# Altium schematic sheet karmanDB_accel.SchDoc
size A
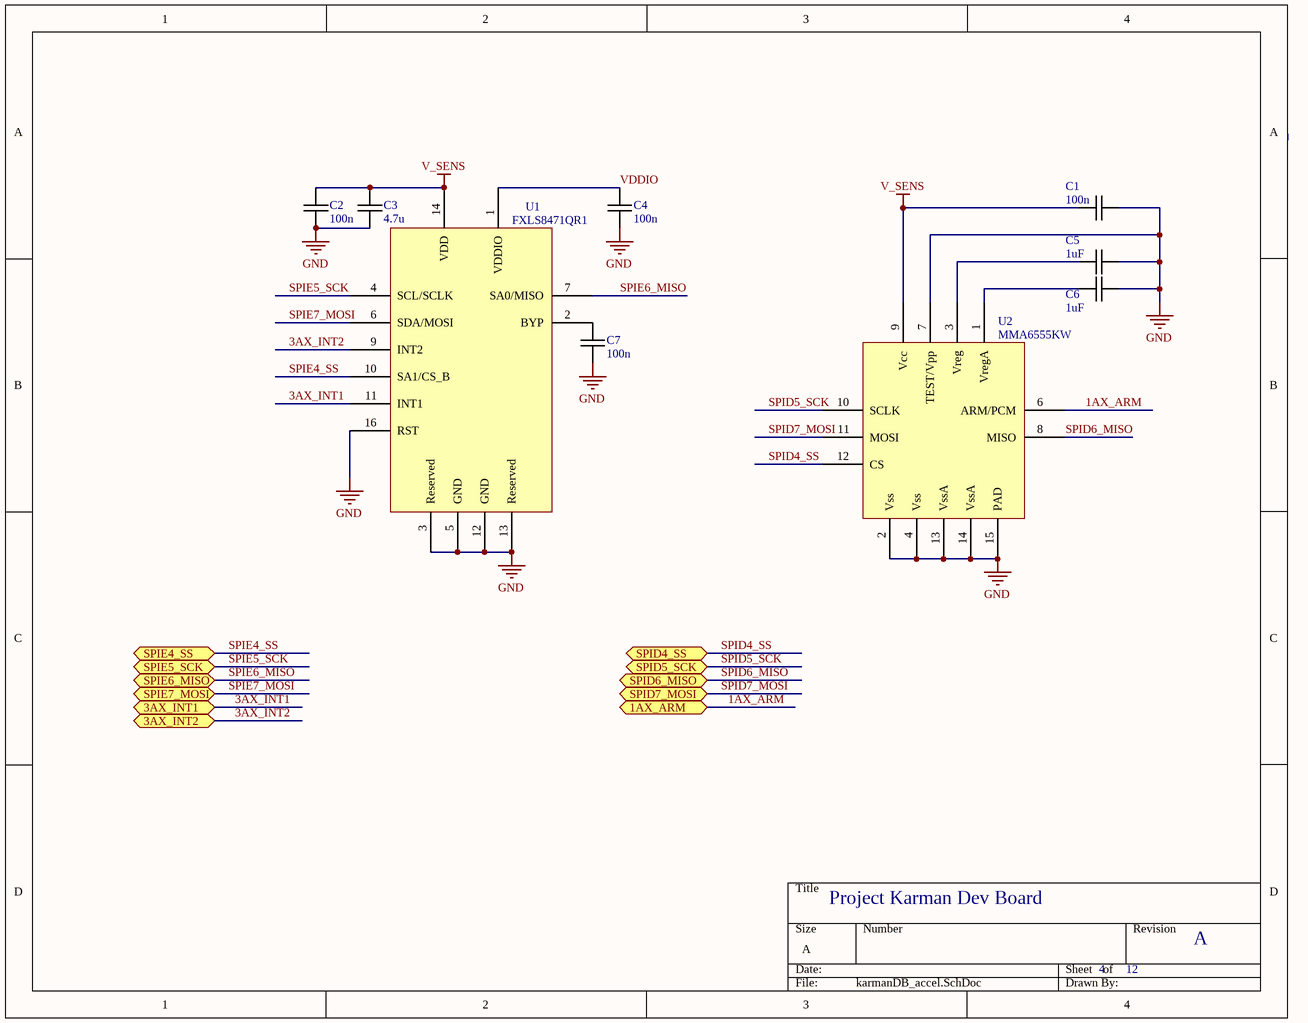
[diagram p0: karmanDB_accel.SchDoc]

## Parts
C1  100n  [MURATA_GRM_0603]
C2  100n  [MURATA_GRM_0603]
C3  4.7u  [MURATA_GRM_0603]
C4  100n  [MURATA_GRM_0603]
C5  1uF  [MURATA_GRM_0402]
C6  1uF  [MURATA_GRM_0402]
C7  100n  [MURATA_GRM_0603]
U1  FXLS8471QR1  [3 FXLS8471QR1]
U2  MMA6555KW  [6 MMA6555KW]

## Ports
1AX_ARM (bidir), 3AX_INT1 (bidir), 3AX_INT2 (bidir), SPID4_SS (bidir), SPID5_SCK (bidir), SPID6_MISO (bidir), SPID7_MOSI (bidir), SPIE4_SS (bidir), SPIE5_SCK (bidir), SPIE6_MISO (bidir), SPIE7_MOSI (bidir)

## Nets
GND: C1.2 C2.2 C3.2 C4.2 C5.1 C6.1 C7.2 U1.3(Reserved) U1.5(GND) U1.12(GND) U1.13(Reserved) U1.16(RST) U2.2(Vss) U2.4(Vss) U2.7(TEST/Vpp) U2.13(VssA) U2.14(VssA) U2.15(PAD)
V_SENS: C1.1 C2.1 C3.1 U1.14(VDD) U2.9(Vcc)
1AX_ARM: U2.6(ARM/PCM) ; port 1AX_ARM
3AX_INT1: U1.11(INT1) ; port 3AX_INT1
3AX_INT2: U1.9(INT2) ; port 3AX_INT2
SPID4_SS: U2.12(CS) ; port SPID4_SS
SPID5_SCK: U2.10(SCLK) ; port SPID5_SCK
SPID6_MISO: U2.8(MISO) ; port SPID6_MISO
SPID7_MOSI: U2.11(MOSI) ; port SPID7_MOSI
SPIE4_SS: U1.10(SA1/CS_B) ; port SPIE4_SS
SPIE5_SCK: U1.4(SCL/SCLK) ; port SPIE5_SCK
SPIE6_MISO: U1.7(SA0/MISO) ; port SPIE6_MISO
SPIE7_MOSI: U1.6(SDA/MOSI) ; port SPIE7_MOSI
VDDIO: C4.1 U1.1(VDDIO)
NetC5_2: C5.2 U2.3(Vreg)
NetC6_2: C6.2 U2.1(VregA)
NetC7_1: C7.1 U1.2(BYP)

Not connected (* = marked no-connect by the designer): U1 8(N/C) 15(N/C)

## Notes on the sheet
- Project Karman Dev Board
- 4
- 12
- A

## Library data of the parts
C1 C2 C4 C7 = CAP_MURATA_GRM188R71C104KA01D: CAP CER 0.1UF 16V 10% X7R 0603; Manufacturer: Murata Electronics North America; Capacitance: 0.1µF; Supplier 1: Digi-Key; Supplier Part Number 1: 490-1532-1-ND; Manufacturer Part Number: GRM188R71C104KA01D; RoHS: RoHS Compliant; Category: Capacitors; Stock 1: 2486193; Pricing: 1=0.1, 10=0.019, 50=0.0102, 100=0.0086, 250=0.00704, 500=0.006, 1000=0.00468 (USD); Packaging: Cut Tape (CT); Tolerance: ±10%; Voltage - Rated: 16V; Temperature Coefficient: X7R; Mounting Type: Surface Mount, MLCC; Operating Temperature: -55°C ~ 125°C; Applications: General Purpose; Ratings: -; Package / Case: 0603 (1608 Metric); Size / Dimension: 0.063" L x 0.031" W (1.60mm x 0.80mm); Height - Seated (Max): -; Thickness (Max): 0.035" (0.90mm); Lead Spacing: -; Features: -; Lead Style: -; ComponentLink1URL: http://www.murata.com/~/media/webrenewal/support/library/catalog/products/capacitor/mlcc/c02e.ashx; ComponentLink1Description: http://www.murata.com/~/media/webrenewal/support/library/catalog/products/capacitor/mlcc/c02e.ashx
C3 = CAP_MURATA_GRM188R61C475MAAJD: CAP CER 4.7UF 16V 20% X5R 0603; Manufacturer: Murata Electronics North America; Capacitance: 4.7µF; Supplier 1: Digi-Key; Supplier Part Number 1: 490-10482-1-ND; Manufacturer Part Number: GRM188R61C475MAAJD; RoHS: RoHS Compliant; Category: Capacitors; Stock 1: 3465; Pricing: 1=0.3, 10=0.251, 25=0.1728, 50=0.1414, 100=0.1256, 250=0.0942, 500=0.08322, 1000=0.07379 (USD); Packaging: Cut Tape (CT); Tolerance: ±20%; Voltage - Rated: 16V; Temperature Coefficient: X5R; Mounting Type: Surface Mount, MLCC; Operating Temperature: -55°C ~ 85°C; Applications: General Purpose; Ratings: -; Package / Case: 0603 (1608 Metric); Size / Dimension: 0.063" L x 0.031" W (1.60mm x 0.80mm); Height - Seated (Max): -; Thickness (Max): 0.037" (0.95mm); Lead Spacing: -; Features: -; Lead Style: -; ComponentLink1URL: http://www.murata.com/~/media/webrenewal/support/library/catalog/products/capacitor/mlcc/c02e.ashx; ComponentLink1Description: http://www.murata.com/~/media/webrenewal/support/library/catalog/products/capacitor/mlcc/c02e.ashx
C5 C6 = CAP_MURATA_GRM155R61A105KE15D: CAP CER 1uF 10volts X5R 10% 0402; Manufacturer: Murata Electronics; Type: General Purpose MLCC; Voltage Rating DC: 10 V; Supplier 1: Mouser; Manufacturer Part Number: GRM155R61A105KE15D; RoHS: RoHS Compliant; Category: Multilayer Ceramic Capacitors MLCC - SMD/SMT; Stock 1: 726006; Pricing 1: 1=0.528, 10=0.066, 100=0.038, 1000=0.030, 2500=0.026, 10000=0.021, 20000=0.019, 50000=0.016, 100000=0.014 (AUD); Capacitance: 1 uF; Height: 0.5 mm; Length: 1 mm; Package / Case: 0402 (1005 metric); Packaging: Reel; Product: General Type MLCCs; Series: GRM; Termination Style: SMD/SMT; Tolerance: 10 %; Width: 0.5 mm; Brand: Murata Electronics; Case Code - in: 0402; Case Code - mm: 1005; Dielectric: X5R; Maximum Operating Temperature: + 85 C; Minimum Operating Temperature: - 55 C; Product Category: High Capacitance SMD Ceramic Chip Capacitors; Standard Pack Qty: 10000; RoHS - Mouser: Y; Minimum Order Quantity: 1; Reeling: True; ComponentLink1URL: http://www.mouser.com/ds/2/281/c02e-2905.pdf; ComponentLink1Description: http://www.mouser.com/ds/2/281/c02e-2905.pdf; Supplier Part Number 1: 81-GRM155R61A105KE15
U1 = FXLS8471QR1: ACCELEROMETER LOW G 3-AXIS DFN; Manufacturer: Freescale Semiconductor; Axis: X, Y, Z; Acceleration Range: ±2g, 4g, 8g; Voltage - Supply: 1.95 V ~ 3.6 V; Output Type: SPI; Bandwidth: 1.5kHz; Interface: I²C, SPI; Supplier 1: Digi-Key; Manufacturer Part Number: FXLS8471QR1; RoHS: RoHS Compliant; Category: Sensors, Transducers; Stock 1: 2987; Pricing 1: 1=1.99, 10=1.775, 25=1.6684, 100=1.5975, 250=1.52652, 500=1.42 (USD); Packaging: Cut Tape (CT); Sensitivity: -; Mounting Type: Surface Mount; Package / Case: 16-VFQFN; Supplier Device Package: 16-QFN (3x3); ComponentLink1URL: http://cache.freescale.com/files/sensors/doc/data_sheet/FXLS8471Q.pdf; ComponentLink1Description: http://cache.freescale.com/files/sensors/doc/data_sheet/FXLS8471Q.pdf; Supplier Part Number 1: FXLS8471QR1CT-ND
U2 = MMA6555KW: Accelerometers X-AXIS 100G; Manufacturer: Freescale Semiconductor; Output Type: Digital; Resolution: 12 bit; Sensitivity: 18.2 LSB/g; Acceleration: 105 g; Interface Type: SPI; Sensing Axis: Single; Operating Supply Current: 7 mA; Supply Voltage - Max: 5 V; Supply Voltage - Min: 3.3 V; Supplier 1: Mouser; Manufacturer Part Number: MMA6555KW; RoHS: RoHS Compliant By Exemption; Category: Accelerometers; Stock 1: 207; Pricing 1: 1=9.30, 10=8.78, 25=8.26, 100=6.19 (AUD); Package / Case: QFN-16; Packaging: Tube; Series: MMA65xx; Brand: Freescale Semiconductor; Standard Pack Qty: 75; RoHS - Mouser: E; Minimum Order Quantity: 1; Reeling: False; ComponentLink1URL: http://www.mouser.com/ds/2/161/MMA655x-482708.pdf; ComponentLink1Description: http://www.mouser.com/ds/2/161/MMA655x-482708.pdf; Supplier Part Number 1: 841-MMA6555KW